# Altium schematic sheet Controller.SchDoc: MSE - CSYEI : DSPic controller
size A3; Author: Guillaume Volery; SheetNumber: 4; SheetTotal: 8; SVN: OUI; Version: 2.1; NoProject: <no>; TitleProject: <project>; PageSetup: Record=PageOptions|CenterHorizontal=True|CenterVertical=True|PrintScale=1.00|XCorrection=1.00|YCorrection=1.00|PrintKind=0|BorderSize=5000000|LeftOffset=0|BottomOffset=0|Orientation=2|PaperLength=1000|PaperWidth=1000|Scale=100|PaperSource=7|PrintQuality=-3|MediaType=1|DitherType=10|PrintScaleMode=1|PaperKind=A4 (210 x 297 mm)|PaperIndex=9
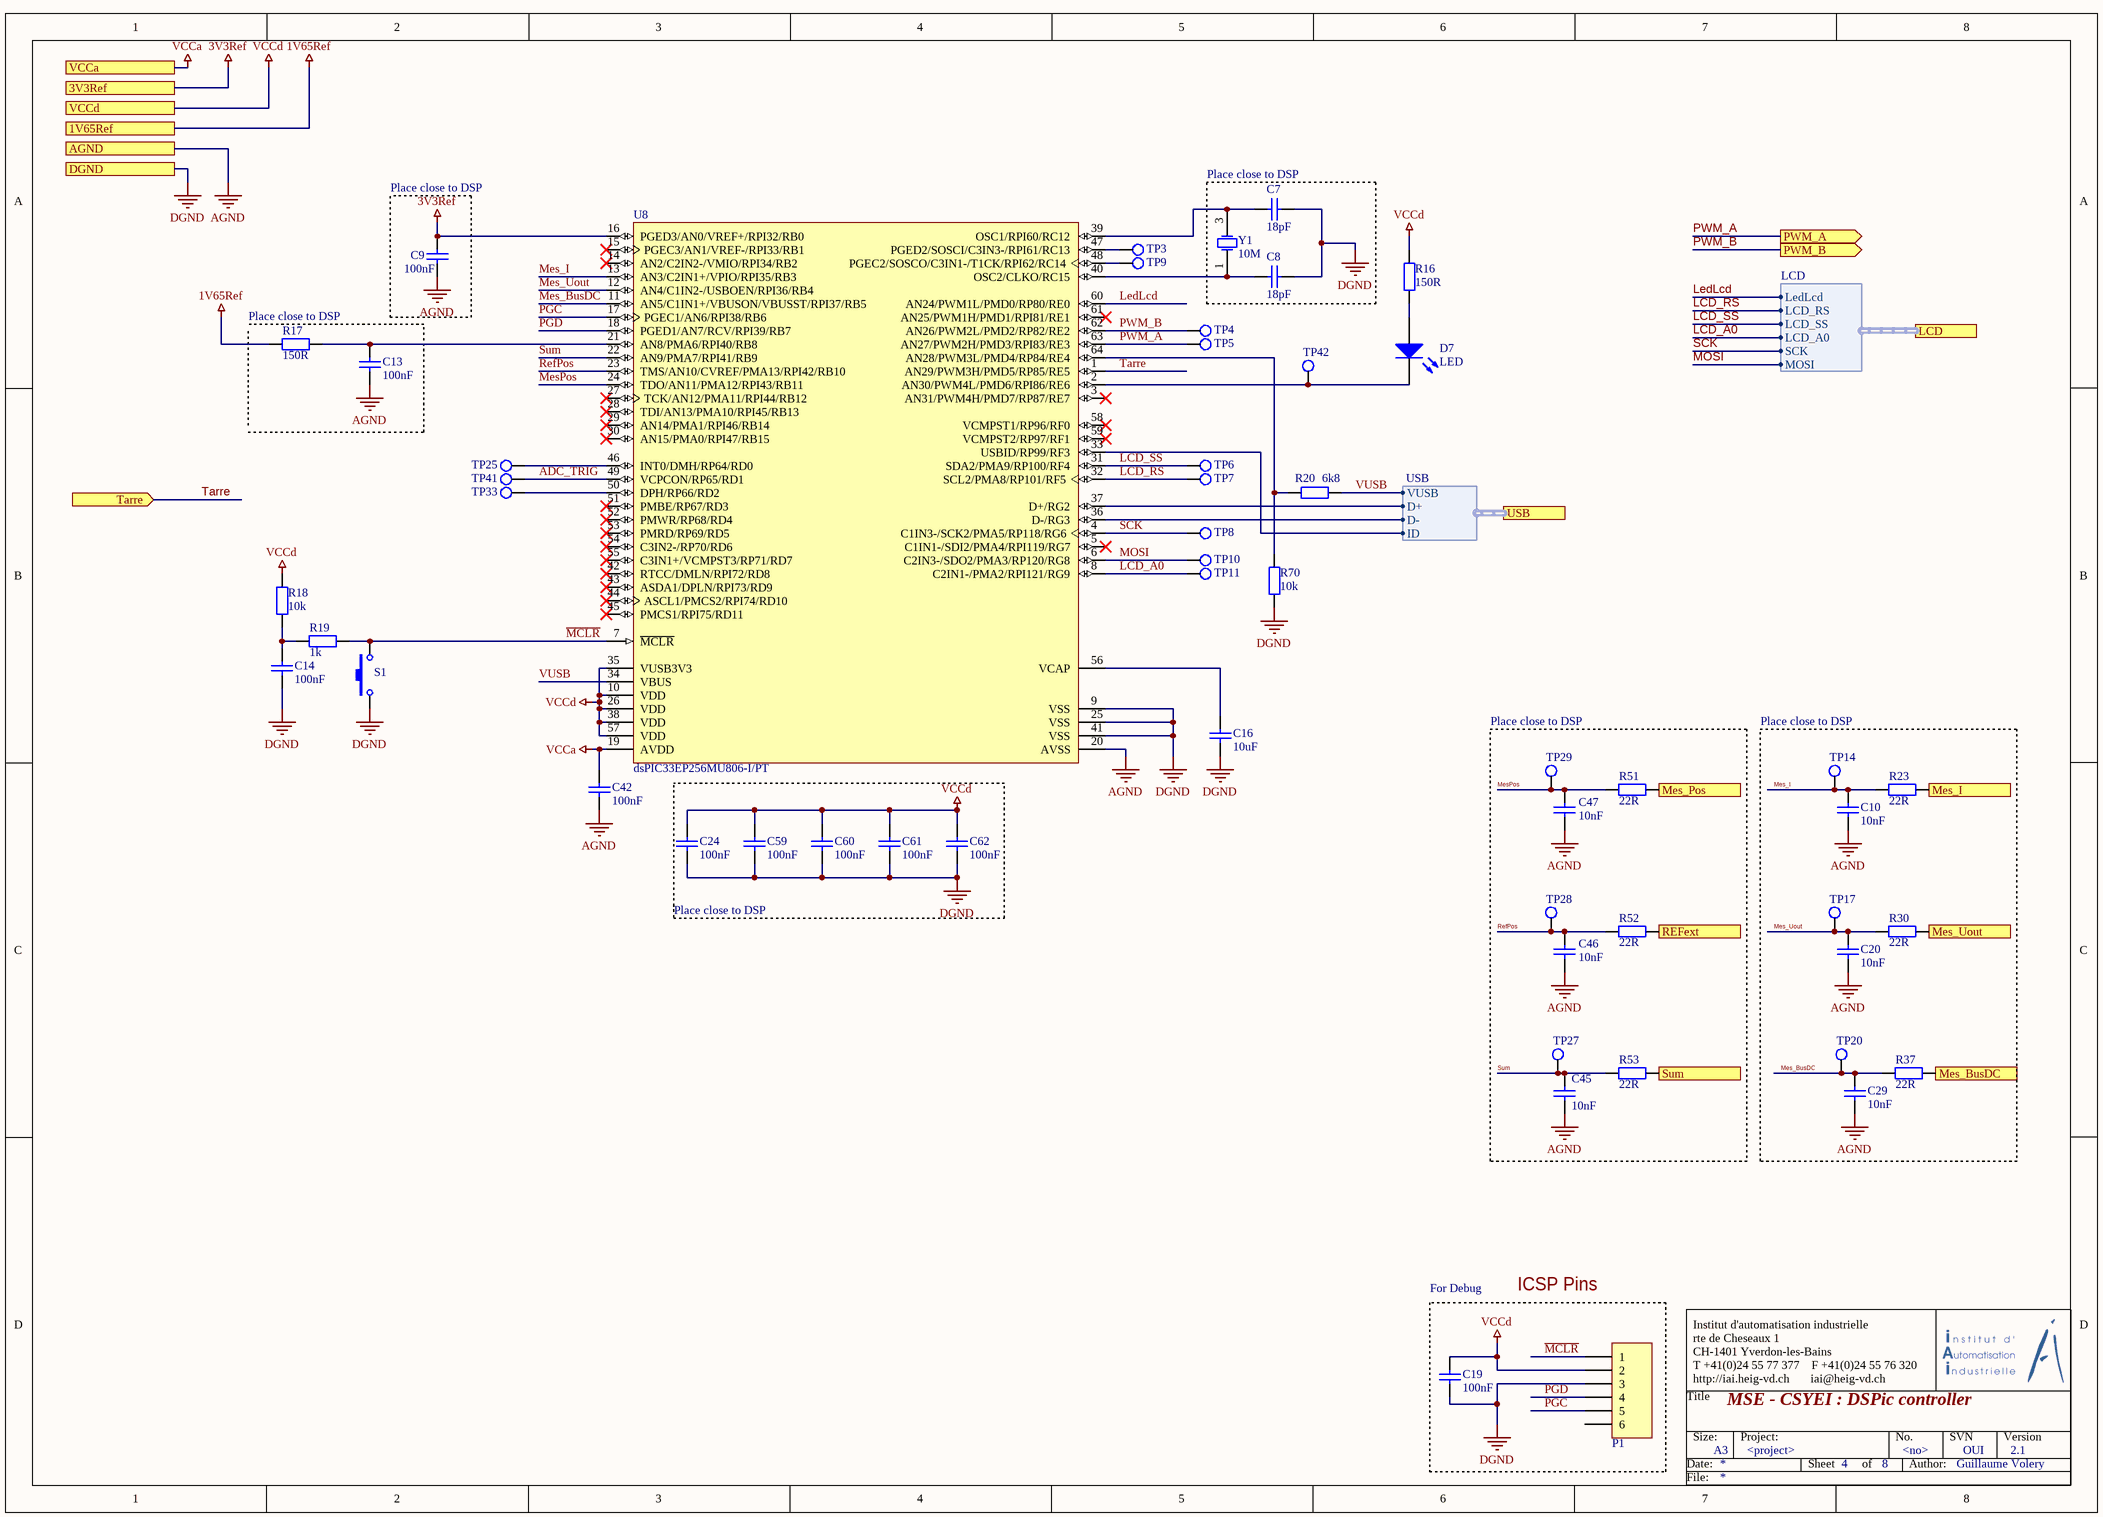
[diagram p0: Controller.SchDoc]

## Parts
C7  18pF  [CAPC2012N]
C8  18pF  [CAPC2012N]
C9  100nF  [CAPC2012N]
C10  10nF  [CAPC2012N]
C13  100nF  [CAPC2012N]
C14  100nF  [CAPC2012N]
C16  10uF  [CAP1206]
C19  100nF  [CAPC2012N]
C20  10nF  [CAPC2012N]
C24  100nF  [CAPC2012N]
C29  10nF  [CAPC2012N]
C42  100nF  [CAPC2012N]
C45  10nF  [CAPC2012N]
C46  10nF  [CAPC2012N]
C47  10nF  [CAPC2012N]
C59  100nF  [CAPC2012N]
C60  100nF  [CAPC2012N]
C61  100nF  [CAPC2012N]
C62  100nF  [CAPC2012N]
D7  LED  [LED2012N]
P1  Connector  [HEADER_6]  (value not drawn)
R16  150R  [RESC2012N]
R17  150R  [RESC2012N]
R18  10k  [RESC2012N]
R19  1k  [RESC2012N]
R20  6k8  [RESC2012N]
R23  22R  [RESC2012N]
R30  22R  [RESC2012N]
R37  22R  [RESC2012N]
R51  22R  [RESC2012N]
R52  22R  [RESC2012N]
R53  22R  [RESC2012N]
R70  10k  [RESC2012N]
S1  SW PTS810  [SW PTS810]  (value not drawn)
TP3  TP  [Testpoint]  (value not drawn)
TP4  TP  [Testpoint]  (value not drawn)
TP5  TP  [Testpoint]  (value not drawn)
TP6  TP  [Testpoint]  (value not drawn)
TP7  TP  [Testpoint]  (value not drawn)
TP8  TP  [Testpoint]  (value not drawn)
TP9  TP  [Testpoint]  (value not drawn)
TP10  TP  [Testpoint]  (value not drawn)
TP11  TP  [Testpoint]  (value not drawn)
TP14  TP  [Testpoint]  (value not drawn)
TP17  TP  [Testpoint]  (value not drawn)
TP20  TP  [Testpoint]  (value not drawn)
TP25  TP  [Testpoint]  (value not drawn)
TP27  TP  [Testpoint]  (value not drawn)
TP28  TP  [Testpoint]  (value not drawn)
TP29  TP  [Testpoint]  (value not drawn)
TP33  TP  [Testpoint]  (value not drawn)
TP41  TP  [Testpoint]  (value not drawn)
TP42  TP  [Testpoint]  (value not drawn)
U8  dsPIC33EP256MU806-I/PT  [TQFP64]
Y1  value 10M  [CRYSTAL_ABMM]  (hidden comment: XTAL)

## Blocks framed on the sheet
Place close to DSP: C7 C8 Y1
Place close to DSP: C9
Place close to DSP: C45-C47 R51-R53 TP27-TP29
Place close to DSP: C10 C20 C29 R23 R30 R37 TP14 TP17 TP20
ICSP Pins: C19 P1

## Ports
1V65Ref, 3V3Ref, AGND, DGND, LCD (harness LCD), Mes_BusDC (in), Mes_I (in), Mes_Pos (in), Mes_Uout (in), PWM_A (out), PWM_B (out), REFext, Sum (in), Tarre (in), USB (harness USB), VCCa, VCCd

## Harnesses
LCD: LCD_RS, LCD_SS, MOSI, SCK, LedLcd, LCD_A0
USB: VUSB, D-, D+, ID

## Nets
1V65Ref: R17.1 ; port 1V65Ref
3V3Ref: C9.2 U8.16(PGED3/AN0/VREF+/RPI32/RB0) ; port 3V3Ref
AGND: C9.1 C10.1 C13.1 C20.1 C29.1 C42.1 C45.1 C46.1 C47.1 U8.20(AVSS) ; port AGND
DGND: C7.2 C8.2 C14.1 C16.1 C19.1 C24.1 C59.1 C60.1 C61.1 C62.1 P1.3 R70.1 S1.1 U8.9(VSS) U8.25(VSS) U8.41(VSS) ; port DGND
VCCa: C42.2 U8.19(AVDD) ; port VCCa
VCCd: C19.2 C24.2 C59.2 C60.2 C61.2 C62.2 P1.2 R16.2 R18.2 U8.10(VDD) U8.26(VDD) U8.35(VUSB3V3) U8.38(VDD) U8.57(VDD) ; port VCCd
~{MCLR}: P1.1 R19.2 S1.3 U8.7(~{MCLR})
ADC_TRIG: TP41.1 U8.49(VCPCON/RP65/RD1)
LCD_A0: TP11.1 U8.8(C2IN1-/PMA2/RPI121/RG9) ; port LCD.LCD_A0
LCD_RS: TP7.1 U8.32(SCL2/PMA8/RP101/RF5) ; port LCD.LCD_RS
LCD_SS: TP6.1 U8.31(SDA2/PMA9/RP100/RF4) ; port LCD.LCD_SS
LedLcd: U8.60(AN24/PWM1L/PMD0/RP80/RE0) ; port LCD.LedLcd
Mes_BusDC: C29.2 R37.1 TP20.1 U8.11(AN5/C1IN1+/VBUSON/VBUSST/RPI37/RB5)
Mes_BusDC: R37.2 ; port Mes_BusDC  [a separate net that carries the same name]
Mes_I: C10.2 R23.1 TP14.1 U8.13(AN3/C2IN1+/VPIO/RPI35/RB3)
Mes_I: R23.2 ; port Mes_I  [a separate net that carries the same name]
Mes_Pos: R51.2 ; port Mes_Pos
Mes_Uout: C20.2 R30.1 TP17.1 U8.12(AN4/C1IN2-/USBOEN/RPI36/RB4)
Mes_Uout: R30.2 ; port Mes_Uout  [a separate net that carries the same name]
MesPos: C47.2 R51.1 TP29.1 U8.24(TDO/AN11/PMA12/RPI43/RB11)
MOSI: TP10.1 U8.6(C2IN3-/SDO2/PMA3/RP120/RG8) ; port LCD.MOSI
PGC: P1.5 U8.17(PGEC1/AN6/RPI38/RB6)
PGD: P1.4 U8.18(PGED1/AN7/RCV/RPI39/RB7)
PWM_A: TP5.1 U8.63(AN27/PWM2H/PMD3/RPI83/RE3) ; port PWM_A
PWM_B: TP4.1 U8.62(AN26/PWM2L/PMD2/RP82/RE2) ; port PWM_B
REFext: R52.2 ; port REFext
RefPos: C46.2 R52.1 TP28.1 U8.23(TMS/AN10/CVREF/PMA13/RPI42/RB10)
SCK: TP8.1 U8.4(C1IN3-/SCK2/PMA5/RP118/RG6) ; port LCD.SCK
Sum: C45.2 R53.1 TP27.1 U8.22(AN9/PMA7/RPI41/RB9)
Sum: R53.2 ; port Sum  [a separate net that carries the same name]
Tarre: U8.1(AN29/PWM3H/PMD5/RP85/RE5) ; port Tarre
VUSB: R20.2 U8.34(VBUS) ; port USB.VUSB
NetC7_1: C7.1 U8.39(OSC1/RPI60/RC12) Y1.3(OSC2)
NetC8_1: C8.1 U8.40(OSC2/CLKO/RC15) Y1.1(OSC1)
NetC13_2: C13.2 R17.2 U8.21(AN8/PMA6/RPI40/RB8)
NetC14_2: C14.2 R18.1 R19.1
NetC16_2: C16.2 U8.56(VCAP)
NetD7_1: D7.1(A) R16.1
NetD7_2: D7.2(K) TP42.1 U8.2(AN30/PWM4L/PMD6/RPI86/RE6)
NetR20_1: R20.1 R70.2 U8.64(AN28/PWM3L/PMD4/RP84/RE4)
NetTP3_1: TP3.1 U8.47(PGED2/SOSCI/C3IN3-/RPI61/RC13)
NetTP9_1: TP9.1 U8.48(PGEC2/SOSCO/C3IN1-/T1CK/RPI62/RC14)
NetTP25_1: TP25.1 U8.46(INT0/DMH/RP64/RD0)
NetTP33_1: TP33.1 U8.50(DPH/RP66/RD2)
NetU8_33: U8.33(USBID/RP99/RF3) ; port USB.ID
NetU8_36: U8.36(D-/RG3) ; port USB.D-
NetU8_37: U8.37(D+/RG2) ; port USB.D+

Not connected (* = marked no-connect by the designer): P1 6; U8 3(AN31/PWM4H/PMD7/RP87/RE7)* 5(C1IN1-/SDI2/PMA4/RPI119/RG7)* 14(AN2/C2IN2-/VMIO/RPI34/RB2)* 15(PGEC3/AN1/VREF-/RPI33/RB1)* 27(TCK/AN12/PMA11/RPI44/RB12)* 28(TDI/AN13/PMA10/RPI45/RB13)* 29(AN14/PMA1/RPI46/RB14)* 30(AN15/PMA0/RPI47/RB15)* 42(RTCC/DMLN/RPI72/RD8)* 43(ASDA1/DPLN/RPI73/RD9)* 44(ASCL1/PMCS2/RPI74/RD10)* 45(PMCS1/RPI75/RD11)* 51(PMBE/RP67/RD3)* 52(PMWR/RP68/RD4)* 53(PMRD/RP69/RD5)* 54(C3IN2-/RP70/RD6)* 55(C3IN1+/VCMPST3/RP71/RD7)* 58(VCMPST1/RP96/RF0)* 59(VCMPST2/RP97/RF1)* 61(AN25/PWM1H/PMD1/RPI81/RE1)*

## Notes on the sheet
- (near R17) Place close to DSP
- Place close to DSP
- For Debug
- Title
- Institut d'automatisation industrielle
  rte de Cheseaux 1
  CH-1401 Yverdon-les-Bains
  T +41(0)24 55 77 377    F +41(0)24 55 76 320
  http://iai.heig-vd.ch       iai@heig-vd.ch
- Date:
- Size:
- A3
- Project:
- Sheet
- of
- No.
- Author:
- SVN
- Version
- File:

## Library data of the parts
C7 C8 = Cap_18pF: Capacitor; Value: 18pF; Supplier 1: Digi-Key; Supplier Part Number 1: 311-1102-1-ND
C9 C13 C14 C19 C24 C42 C59-C62 = Cap_100nF: Capacitor; Value: 100nF; Supplier 1: Digi-Key; Supplier Part Number 1: 478-1395-1-ND
C10 C20 C29 C45-C47 = Cap_10nF: Capacitor; Value: 10nF; Supplier 1: Digi-Key; Supplier Part Number 1: 311-1136-1-ND
C16 = Cap_10uF: Capacitor; Value: 10uF; Supplier 1: Digi-Key; Supplier Part Number 1: 445-7886-1-ND
D7 = Led_Rouge_0805: Supplier 1: Digi-Key; Supplier Part Number 1: 475-1415-1-ND
P1 = Header 6: Header, 6-Pin; Supplier Part Number 1: S9015E-03-ND; Supplier 1: Digi-Key
R16 R17 = Res_150R: Resistor; Value: 150R; Supplier 1: Digi-Key; Supplier Part Number 1: 311-150CRCT-ND
R18 R70 = Res_10k: Resistor; Value: 10k; Supplier 1: Digi-Key; Supplier Part Number 1: 311-10.0KCRCT-ND
R19 = Res__1k: Resistor; Value: 1k; Supplier 1: Digi-Key; Supplier Part Number 1: 311-1.00KCRCT-ND
R20 = Res_6k8: Resistor; Value: 6k8; Supplier 1: Digi-Key; Supplier Part Number 1: 311-6.80KCRCT-ND
R23 R30 R37 R51-R53 = Res_22R: Resistor; Value: 22R; Supplier 1: Digi-Key; Supplier Part Number 1: 311-22.0CRCT-ND
S1 = SW PTS810: Switch; Supplier 1: Digi-Key; Supplier Part Number 1: CKN10502CT-ND
TP3-TP11 TP14 TP17 TP20 TP25 TP27-TP29 TP33 TP41 TP42 = TP: =Value; Supplier 1: Digi-Key; Supplier Part Number 1: 36-5006-ND
U8 = dsPIC33EP256MU806-I/PT: 16-Bit Digital Signal Processor; Supplier 1: Digi-Key; Supplier Part Number 1: DSPIC33EP256MU806-I/PT-ND; Value: DSPIC33EP256MU806-I/PT
Y1 = XTAL: Crystal Oscillator; Supplier 1: Digi-Key; Supplier Part Number 1: 535-9150-1-ND